# EAGLE design FH Charge Board (EAGLE 8.3.1)
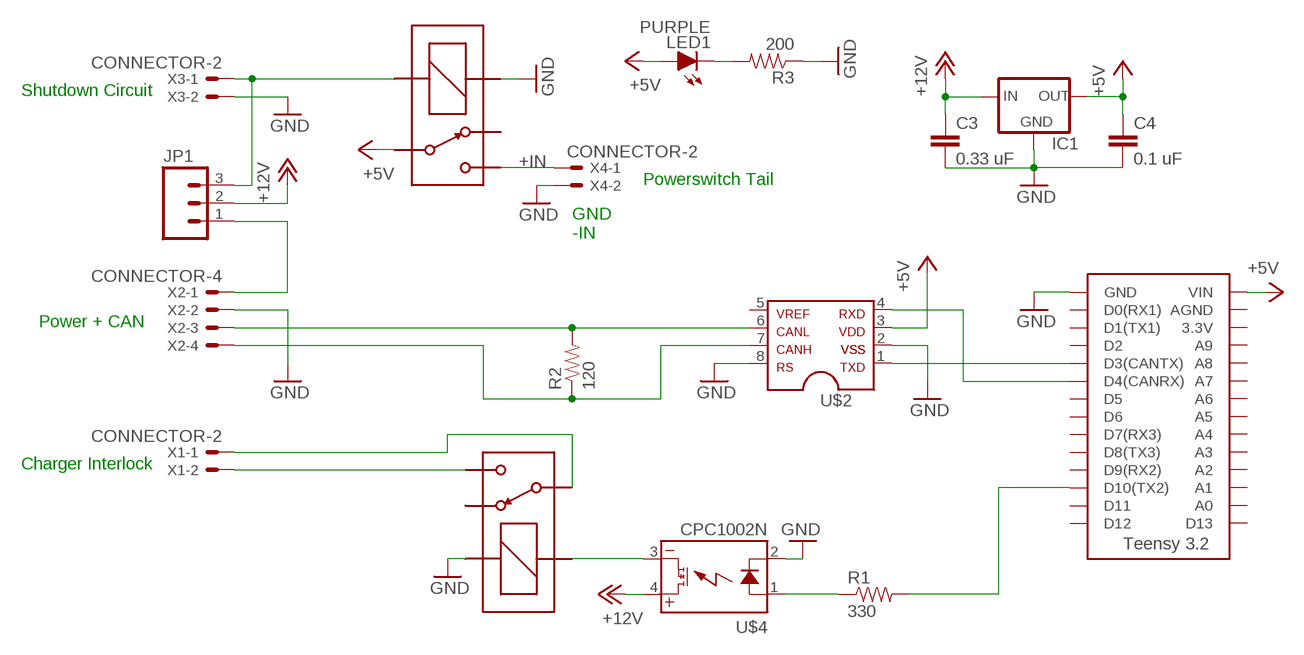
[diagram p0: schematic, sheet 1]

## Parts
C3  0.33 uF  CAP0805  [0805]
C4  0.1 uF  CAP0805  [0805]
IC1  5VREG_L7805SPACED  [TO-220-SPACED]
JP1  M03  [1X03]
LED1  PURPLE  LED-0805  [LED-805]
R1  330  RESISTOR0805-RES  [0805]
R2  120  RESISTOR0805-RES  [0805]
R3  200  RESISTOR0805-RES  [0805]
U$1  G5LE  [ZF112]
U$2  MCP2551DIL  [DIL08]
U$3  TEENSY_3.2_SIMPLE  [TEENSY_3.2_SIMPLE]
U$4  CPC1002N  [SOP04]
U$5  G5LE  [ZF112]
X1  CONNECTOR-2  [MINIFIT_5566-2]
X2  CONNECTOR-4  [MINIFIT_5566-4]
X3  CONNECTOR-2  [MINIFIT_5566-2]
X4  CONNECTOR-2  [MINIFIT_5566-2]

## Nets
+5V: C4.1 IC1.3(OUT) LED1.A U$1.P U$2.3 U$3.VIN
+12V: C3.1 IC1.1(IN) JP1.2 U$4.4(DC+)
+IN: U$1.S X4.1
CANH: R2.1 U$2.7 X2.4
CANL: R2.2 U$2.6 X2.3
GND: C3.2 C4.2 IC1.2(GND) R3.1 U$1.1(COIL+) U$2.2 U$2.8 U$3.GND U$4.2(CONTROL-) U$5.1(COIL+) X2.2 X3.2 X4.2
N$2: LED1.C R3.2
N$6: U$5.S X1.2
N$11: R1.2 U$3.D10(TX2)
N$12: U$4.3(DC-) U$5.2(COIL-)
N$13: R1.1 U$4.1(CONTROL+)
N$14: U$5.P X1.1
POWER_CAN_12V: JP1.1 X2.1
SHUTDOWN_12V: JP1.3 U$1.2(COIL-) X3.1
UC_CANRX: U$2.4 U$3.D4(CANRX)
UC_CANTX: U$2.1 U$3.D3(CANTX)
Unconnected: U$1.O U$2.5 U$3.3.3V U$3.A0 U$3.A1 U$3.A2 U$3.A3 U$3.A4 U$3.A5 U$3.A6 U$3.A7 U$3.A8 U$3.A9 U$3.AGND U$3.D0(RX1) U$3.D1(TX1) U$3.D2 U$3.D5 U$3.D6 U$3.D7(RX3) U$3.D8(TX3) U$3.D9(RX2) U$3.D11 U$3.D12 U$3.D13 U$5.O

## Notes on the sheet
- Shutdown Circuit
- Powerswitch Tail
- GND
  -IN
- Power + CAN
- Charger Interlock

## Library data of the parts
C3 C4 = HyTechDevices:CAP: Capacitor Standard 0603 ceramic capacitor, and 0.1" leaded capacitor.
IC1 = HyTechDevices:5VREG_L7805: Voltage Regulator Switching 5v regulator Datasheet <http://power.murata.com/data/power/oki-78sr.pdf> Standard 7805 5V regulator. IGO (Input Ground Output). Spark Fun Electronics SKU : COM-00107 Datasheet <http://www.mouser.com/ds/2/308/MC7800-D-94905.pdf>
JP1 = HyTechDevices:M03: Standard 3-pin 0.1" header.
LED1 = HyTechDevices:LED: Light Emitting Diode (LED) Source: Dangerous Prototypes Eagle Library <https://github.com/DangerousPrototypes/Eagle_Part_Library>
R1-R3 = HyTechDevices:RESISTOR: Resistor Basic schematic elements and footprints for 0603, 1206, and PTH resistors.
U$1 U$5 = HyTechDevices:G5LE: Omron G5LE SPST Relay 5 VDC, 12VDC, 24VDC models Coil voltage: 75% - 170% of nominal voltage Datasheet <https://www.omron.com/ecb/products/pdf/en-g5le.pdf>
U$2 = HyTechDevices:MCP2551: MCP2551 High-Speed CAN Transceiver Product Webpage <https://www.microchip.com/wwwproducts/en/MCP2551> Datasheet <http://ww1.microchip.com/downloads/en/DeviceDoc/21667f.pdf> This device is outdated It is replaced by MCP2561. Comparison Page <https://www.microchip.com/wwwproducts/ProductCompare/MCP2551/MCP2561> Product Webpage <https://www.microchip.com/wwwproducts/en/MCP2561> Datasheet <http://ww1.microchip.com/downloads/en/DeviceDoc/20005167C.pdf>
U$3 = HyTechDevices:TEENSY_3.2_SIMPLE: Simple version of the Teensy 3.2 board that only uses the 2 main rows of pins, not the inner pins or the pins opposite the usb port.
U$4 = HyTechDevices:CPC1002N: IXYS Solid State Relay .7A
X1 X3 X4 = HyTechDevices:CONNECTOR-2: Mini-Fit Junior connector 2 pole Source: http://www.molex.com; OC_FARNELL: 1822072; OC_NEWARK: unknown
X2 = HyTechDevices:CONNECTOR-4: Mini-Fit Junior connector 4 pole Source: http://www.molex.com; OC_FARNELL: unknown; OC_NEWARK: unknown

## Board
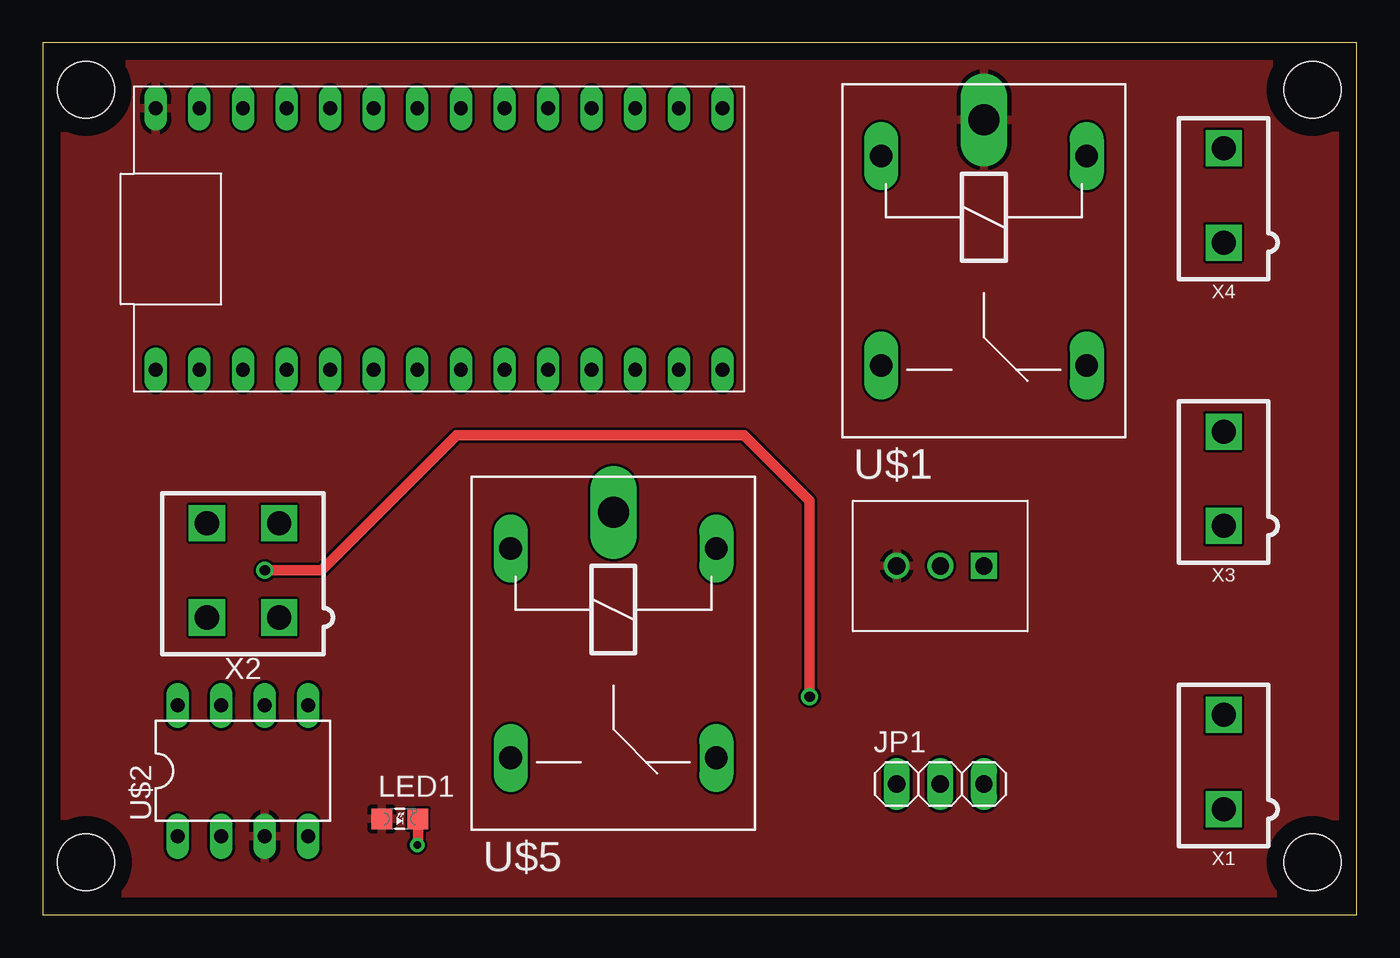
[diagram p1: board, top side]
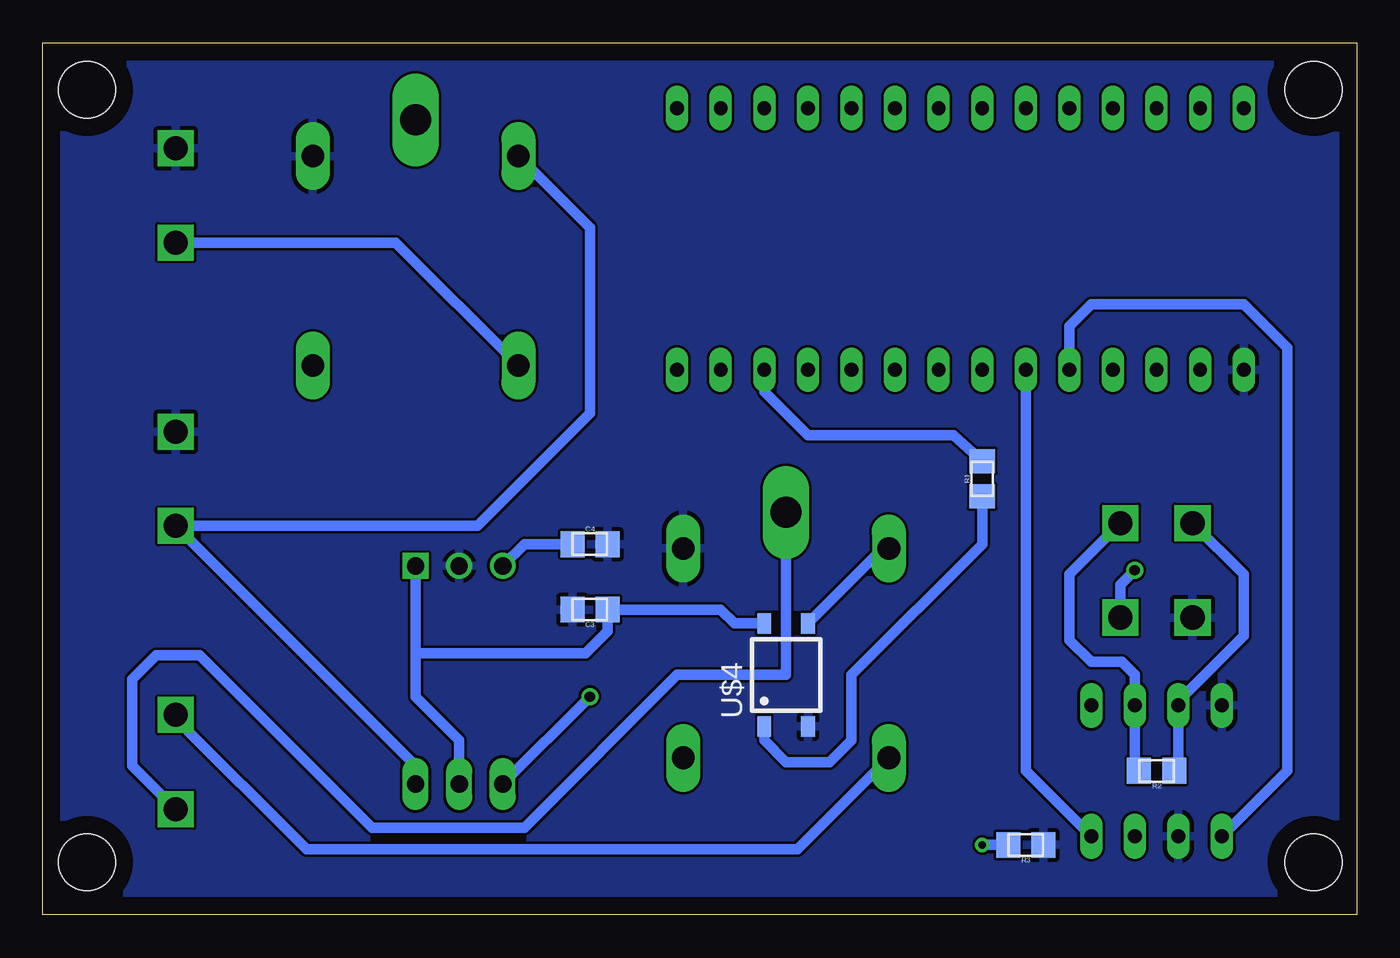
[diagram p2: board, bottom side, seen from below]

Size 76.56 x 50.79 mm. Coordinates in mm from the lower left corner, seen from the top.
Outline: 0,0 76.56,0 76.56,50.79 0,50.79 0,0
Copper layers (1*16): Top 0.035mm / dielectric 1.5mm / Bottom 0.035mm
Design rules "DRC Advanced Circuits": minimum track width 6mil, minimum drill 15mil, track to track 6mil, track to pad 6mil, pad to pad 6mil, via to via 6mil, smd to smd 6mil, copper to edge 40mil, drill to drill 6mil, minimum pad ring 10mil, minimum via ring 8mil, stop-mask expansion 4mil, vias tented up to drill 0mil, thermal gap 10mil
Holes 3.3 mm at 2.5,48.06 2.5,3.06 74,48.06 74,3.06

### Footprints (pad centres in the part's own frame; a part is rotated, then mirrored left to right if it is on the bottom)
0805 = smd 1.4 x 1.5: 1 -1.025,0; 2 1.025,0
TO-220-SPACED = drill 1 square: 1 -2.54,0 | drill 1: 2 0,0; 3 2.54,0
1X03 = drill 1.016 long: 1 -2.54,0; 2 0,0; 3 2.54,0
LED-805 = smd 1.2 x 1.2: A 0,-1.05; C 0,1.05
ZF112 = drill 1.321 long: 1 4.064,14.884; 2 4.064,2.896; O 16.256,14.884; S 16.256,2.896 | drill 1.803 long: P 1.956,8.89
DIL08 = drill 0.813 long: 1 -3.81,-3.81; 2 -1.27,-3.81; 3 1.27,-3.81; 4 3.81,-3.81; 5 3.81,3.81; 6 1.27,3.81; 7 -1.27,3.81; 8 -3.81,3.81
TEENSY_3.2_SIMPLE = drill 0.8 long: 3.3V 16.51,29.21; A0 16.51,3.81; A1 16.51,6.35; A2 16.51,8.89; A3 16.51,11.43; A4 16.51,13.97; A5 16.51,16.51; A6 16.51,19.05; A7 16.51,21.59; A8 16.51,24.13; A9 16.51,26.67; AGND 16.51,31.75; D0(RX1) 1.27,31.75; D1(TX1) 1.27,29.21; D2 1.27,26.67; D3(CANTX) 1.27,24.13; D4(CANRX) 1.27,21.59; D5 1.27,19.05; D6 1.27,16.51; D7(RX3) 1.27,13.97; D8(TX3) 1.27,11.43; D9(RX2) 1.27,8.89; D10(TX2) 1.27,6.35; D11 1.27,3.81; D12 1.27,1.27; D13 16.51,1.27; GND 1.27,34.29; VIN 16.51,34.29
SOP04 = smd 0.8 x 1.2: 1 -1.27,-3; 2 1.27,-3; 3 1.27,3; 4 -1.27,3
MINIFIT_5566-2 = drill 1.4 square: 1 0,-2.75; 2 0,2.75
MINIFIT_5566-4 = drill 1.4 square: 1 2.1,-2.75; 2 -2.1,-2.75; 3 2.1,2.75; 4 -2.1,2.75

### Placement (x,y rotation side)
C3  44.68,17.78 180 bottom
C4  44.68,21.59 0 bottom
IC1  52.3,20.32 180 top
JP1  52.3,7.62 0 top
LED1  20.8,5.59 270 top
R1  21.82,25.4 90 bottom
R2  11.66,8.38 180 bottom
R3  19.28,4.06 180 bottom
U$1  45.95,48.26 270 top
U$2  11.66,8.38 0 top
U$3  40.87,30.48 90 top
U$4  33.25,13.97 0 bottom
U$5  24.36,25.4 270 top
X1  68.81,8.89 0 top
X2  11.66,20.07 0 top
X3  68.81,25.4 0 top
X4  68.81,41.91 0 top

### Tracks (layer width: path | path; a pad name or v marks a point on that pad's centre or on a via)
+5V
  Bottom 0.6: IC1.3 48.49,21.59 C4.1
  pour Top: 0,50.8 0,0 76.39,0 76.39,50.8
+12V
  Bottom 0.6: IC1.1 54.84,15.24 44.93,15.24 | C3.1 37.06,17.78 36.25,16.97 U$4.4
  Bottom 0.61: 54.84,15.24 54.84,12.7 52.3,10.16 JP1.2 | C3.1 43.66,16.52 44.93,15.24
+IN
  Bottom 0.61: X4.1 56,39.16 U$1.S
CANH
  Bottom 0.61: X2.4 6.58,19.84 6.58,16.26 10.39,12.45 U$2.7 10.39,8.63 R2.1
CANL
  Bottom 0.61: X2.3 16.74,19.84 16.74,16 15.47,14.73 13.69,14.73 12.93,13.97 U$2.6 12.93,8.63 R2.2
GND
  pour Bottom: 0,50.8 0,0 76.39,0 76.39,50.8
N$2  (via drill 0.45)
  Top 0.61: LED1.C 21.85,4.1 v21.82,4.06
  Bottom 0.61: v21.82,4.06 R3.2
N$6
  Bottom 0.61: U$5.S 32.59,3.81 61.19,3.81 68.81,11.43 X1.2
N$11
  Bottom 0.61: R1.2 23.51,27.94 31.98,27.94 34.52,30.48 U$3.D10(TX2)
N$12
  Bottom 0.6: U$4.3 27.61,21.34 U$5.2
N$13
  Bottom 0.61: R1.1 21.82,21.59 29.44,13.97 29.44,10.16 30.71,8.89 33.25,8.89 34.52,10.16 U$4.1
N$14
  Bottom 0.61: X1.1 71.35,8.68 71.35,13.72 69.95,15.11 67.41,15.11 57.38,5.08 48.49,5.08 39.6,13.97 33.25,13.97 U$5.P
POWER_CAN_12V  (via drill 0.6)
  Top 0.61: v44.68,12.7 44.68,24.13 40.87,27.94 24.11,27.94 16.23,20.07 v12.93,20.07
  Bottom 0.61: X2.1 13.76,19.24 v12.93,20.07 | v44.68,12.7 JP1.1
SHUTDOWN_12V
  Bottom 0.61: U$1.2 44.68,40.03 44.68,29.21 51.24,22.65 X3.1 54.84,8.68 JP1.3
UC_CANRX
  Bottom 0.61: U$2.4 19.28,8.38 U$3.D4(CANRX)
UC_CANTX
  Bottom 0.61: U$2.1 4.04,8.38 4.04,33.02 6.58,35.56 15.47,35.56 16.74,34.29 U$3.D3(CANTX)

### Text on the board
tDocu: PowerSwitch / Tail | Power + CAN | Shutdown / Circuit | Charger / Interlock | Spiritual support by Choukri Nyon | Schematic by Sai Kilaru | Board by Soohyun Kim | HyTech 2018 FH Charger Controller Board rev0